# EAGLE schematic fnordlichtmini_v4 (EAGLE 6.1)
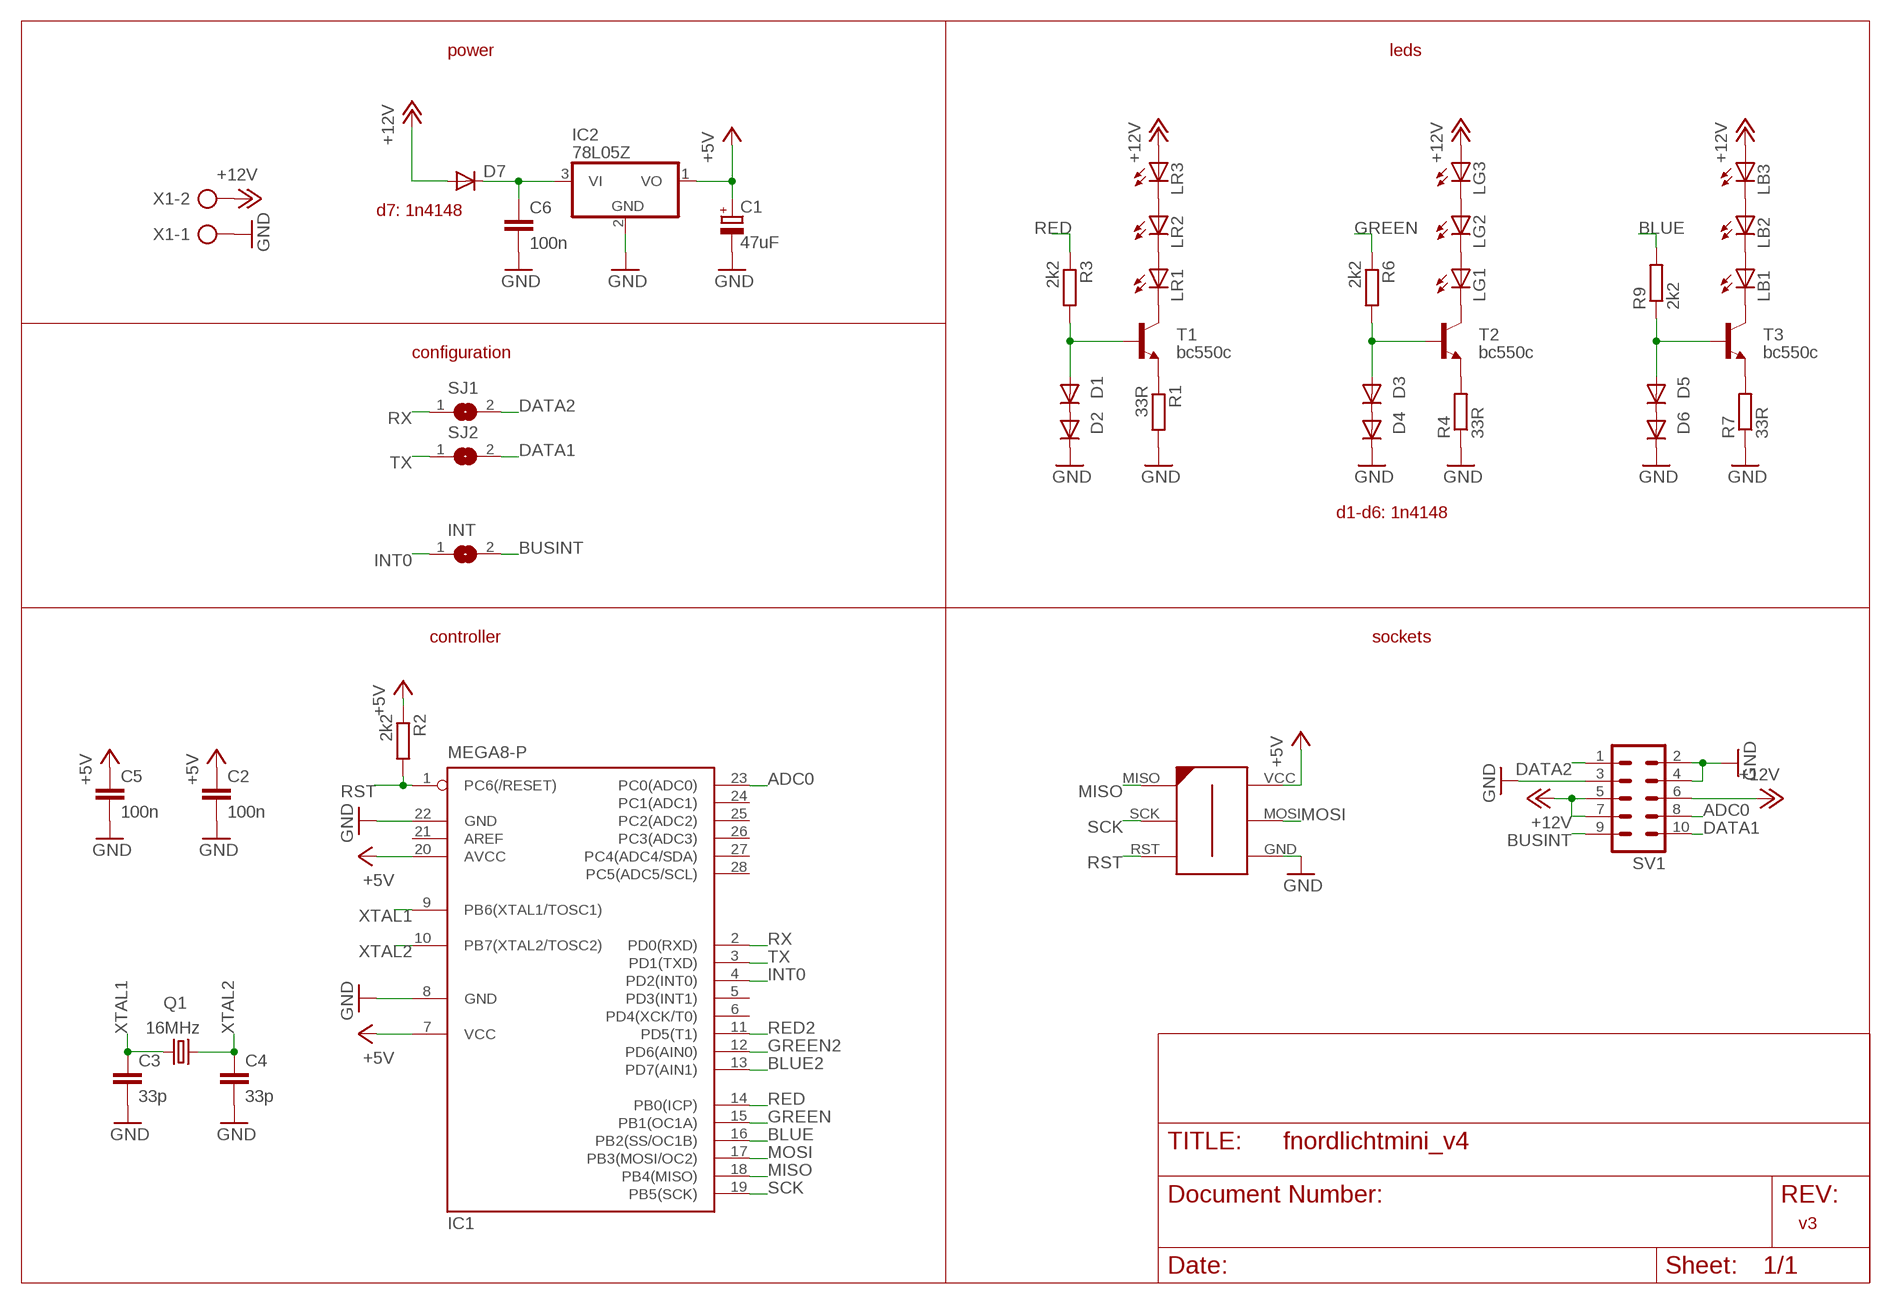
[diagram p0: schematic, sheet 1]

## Parts
C1  47uF  CPOL-EUE2-5  [E2-5]
C2  100n  C-EU025-024X044  [C025-024X044]
C3  33p  C-EU025-024X044  [C025-024X044]
C4  33p  C-EU025-024X044  [C025-024X044]
C5  100n  C-EU025-024X044  [C025-024X044]
C6  100n  C-EU025-024X044  [C025-024X044]
D1  DIODE-D-2.5  [D-2.5]
D2  DIODE-D-2.5  [D-2.5]
D3  DIODE-D-2.5  [D-2.5]
D4  DIODE-D-2.5  [D-2.5]
D5  DIODE-D-2.5  [D-2.5]
D6  DIODE-D-2.5  [D-2.5]
D7  DIODE-D-2.5  [D-2.5]
IC1  MEGA8-P  [DIL28-3]
IC2  78L05Z  [TO92]
INT  SJ  [SJ]
LB1  LED5MM  [LED5MM]
LB2  LED5MM  [LED5MM]
LB3  LED5MM  [LED5MM]
LG1  LED5MM  [LED5MM]
LG2  LED5MM  [LED5MM]
LG3  LED5MM  [LED5MM]
LR1  LED5MM  [LED5MM]
LR2  LED5MM  [LED5MM]
LR3  LED5MM  [LED5MM]
Q1  16MHz  CRYSTALHC49U-V  [HC49U-V]
R1  33R  R-EU_0204/2V  [0204V]
R2  2k2  R-EU_0204/2V  [0204V]
R3  2k2  R-EU_0204/2V  [0204V]
R4  33R  R-EU_0204/2V  [0204V]
R6  2k2  R-EU_0204/2V  [0204V]
R7  33R  R-EU_0204/2V  [0204V]
R9  2k2  R-EU_0204/2V  [0204V]
SJ1  SJ  [SJ]
SJ2  SJ  [SJ]
SV1  MA05-2  [MA05-2]
T1  bc550c  -NPN-TO92  [TO92]
T2  bc550c  -NPN-TO92  [TO92]
T3  bc550c  -NPN-TO92  [TO92]
U$1  AVR-ISP-6-EDGE  [6PAD_ISP]
X1  AK500/2  [AK500/2]

## Nets
+5V: C1.+ C2.1 C5.1 IC1.7(VCC) IC1.20(AVCC) IC2.1(VO) R2.1 U$1.VCC
+12V: D7.A LB3.A LG3.A LR3.A SV1.5 SV1.6 SV1.7 X1.2
ADC0: IC1.23(PC0(ADC0)) SV1.8
BLUE: IC1.16(PB2(SS/OC1B)) R9.2
BLUE2: IC1.13(PD7(AIN1))
BUSINT: INT.2 SV1.9
DATA1: SJ2.2 SV1.10
DATA2: SJ1.2 SV1.1
GND: C1.- C2.2 C3.2 C4.2 C5.2 C6.2 D2.C D4.C D6.C IC1.8(GND) IC1.22(GND) IC2.2(GND) R1.2 R4.1 R7.1 SV1.2 SV1.3 SV1.4 U$1.GND X1.1
GREEN: IC1.15(PB1(OC1A)) R6.1
GREEN2: IC1.12(PD6(AIN0))
INT0: IC1.4(PD2(INT0)) INT.1
MISO: IC1.18(PB4(MISO)) U$1.MISO
MOSI: IC1.17(PB3(MOSI/OC2)) U$1.MOSI
N$1: LR2.A LR3.K(C)
N$2: LR1.A LR2.K(C)
N$3: LR1.K(C) T1.3(C)
N$4: D1.C D2.A
N$5: R1.1 T1.1(E)
N$7: D1.A R3.2 T1.2(B)
N$8: LG2.A LG3.K(C)
N$9: LG1.A LG2.K(C)
N$10: LG1.K(C) T2.3(C)
N$11: D3.C D4.A
N$12: R4.2 T2.1(E)
N$14: D3.A R6.2 T2.2(B)
N$15: LB2.A LB3.K(C)
N$16: LB1.A LB2.K(C)
N$17: LB1.K(C) T3.3(C)
N$18: D5.C D6.A
N$19: R7.2 T3.1(E)
N$21: D5.A R9.1 T3.2(B)
N$22: C6.1 D7.C IC2.3(VI)
RED: IC1.14(PB0(ICP)) R3.1
RED2: IC1.11(PD5(T1))
RST: IC1.1(PC6(/RESET)) R2.2 U$1.RST
RX: IC1.2(PD0(RXD)) SJ1.1
SCK: IC1.19(PB5(SCK)) U$1.SCK
TX: IC1.3(PD1(TXD)) SJ2.1
XTAL1: C3.1 IC1.9(PB6(XTAL1/TOSC1)) Q1.1
XTAL2: C4.1 IC1.10(PB7(XTAL2/TOSC2)) Q1.2
Unconnected: IC1.5(PD3(INT1)) IC1.6(PD4(XCK/T0)) IC1.21(AREF) IC1.24(PC1(ADC1)) IC1.25(PC2(ADC2)) IC1.26(PC3(ADC3)) IC1.27(PC4(ADC4/SDA)) IC1.28(PC5(ADC5/SCL))

## Notes on the sheet
- power | leds
- d7: 1n4148
- configuration
- d1-d6: 1n4148
- controller | sockets
- v3

## Library data of the parts
C1 = rcl:CPOL-EU: POLARIZED CAPACITOR, European symbol
C2-C6 = rcl:C-EU: CAPACITOR, European symbol
D1-D7 = diode:DIODE-: DIODE
IC1 = atmel:MEGA8-P: MICROCONTROLLER 8 Kbytes FLASH, 1 kbytes SRAM, 512 bytes EEPROM, USART, 4-channel 10 bit ADC, 2-channel 8 bit ADC Pin compatible with Atmega48, ATMega88, ATMega168 Source: avr.lbr
IC2 = linear:78*: Positive VOLTAGE REGULATOR Source: http://cache.national.com/ds/LM/LM78L05.pdf http://www.fairchildsemi.com/ds/LM/LM7805.pdf
INT SJ1 SJ2 = jumper:SJ: SMD solder JUMPER
LB1-LB3 LG1-LG3 LR1-LR3 = led-mark:LED: LED OSRAM: - CHIPLED LG R971, LG N971, LY N971, LG Q971, LY Q971, LO R971, LY R971 LH N974, LH R974 LS Q976, LO Q976, LY Q976 LO Q996 - Hyper CHIPLED LW Q18S LB Q993, LB Q99A, LB R99A - SideLED LS A670, LO A670, LY A670, LG A670, LP A670 LB A673, LV A673, LT A673, LW A673 LH A674 LY A675 LS A676, LA A676, LO A676, LY A676, LW A676 LS A679, LY A679, LG A679 - Hyper Micro SIDELED® LS Y876, LA Y876, LO Y876, LY Y876 LT Y87S - SmartLED LW L88C, LW L88S LB L89C, LB L89S, LG L890 LS L89K, LO L89K, LY L89K LS L896, LA L896, LO L896, LY L896 - TOPLED LS T670, LO T670, LY T670, LG T670, LP T670 LSG T670, LSP T670, LSY T670, LOP T670, LYG T670 LG T671, LOG T671, LSG T671 LB T673, LV T673, LT T673, LW T673 LH T674 LS T676, LA T676, LO T676, LY T676, LB T676, LH T676, LSB T676, LW T676 LB T67C, LV T67C, LT T67C, LS T67K, LO T67K, LY T67K, LW E67C LS E67B, LA E67B, LO E67B, LY E67B, LB E67C, LV E67C, LT E67C LW T67C LS T679, LY T679, LG T679 LS T770, LO T770, LY T770, LG T770, LP T770 LB T773, LV T773, LT T773, LW T773 LH T774 LS E675, LA E675, LY E675, LS T675 LS T776, LA T776, LO T776, LY T776, LB T776 LHGB T686 LT T68C, LB T68C - Hyper Mini TOPLED® LB M676 - Mini TOPLED Santana® LG M470 LS M47K, LO M47K, LY M47K Source: http://www.osram.convergy.de LUXEON: - LUMILED® LXK2-PW12-R00, LXK2-PW12-S00, LXK2-PW14-U00, LXK2-PW14-V00 LXK2-PM12-R00, LXK2-PM12-S00, LXK2-PM14-U00 LXK2-PE12-Q00, LXK2-PE12-R00, LXK2-PE12-S00, LXK2-PE14-T00, LXK2-PE14-U00 LXK2-PB12-K00, LXK2-PB12-L00, LXK2-PB12-M00, LXK2-PB14-N00, LXK2-PB14-P00, LXK2-PB14-Q00 LXK2-PR12-L00, LXK2-PR12-M00, LXK2-PR14-Q00, LXK2-PR14-R00 LXK2-PD12-Q00, LXK2-PD12-R00, LXK2-PD12-S00 LXK2-PH12-R00, LXK2-PH12-S00 LXK2-PL12-P00, LXK2-PL12-Q00, LXK2-PL12-R00 Source: www.luxeon.com KINGBRIGHT: KA-3528ASYC Source: www.kingbright.com
Q1 = crystal:CRYSTAL: CRYSTAL
R1-R4 R6 R7 R9 = rcl:R-EU_: RESISTOR, European symbol
SV1 = con-lstb:MA05-2: PIN HEADER
T1-T3 = transistor:*-NPN-: NPN Transistror BF959 corrected 2008.03.06
U$1 = isp:AVR-ISP-6-EDGE: 6 pin edge connector for ISP with ATMEL MCUs. Developed by Craig Moates (craig at moates dot net). Library by David Blundell (blundar at gmail dot com). Often, even a 6 pin header is really inconvenient for board layout and/or production. This SMD-only header is our de-facto standard for using an edge connector for programming with the help of a 6pin/10pin to edge card adapter.
X1 = con-ptr500:AK500/2: CONNECTOR